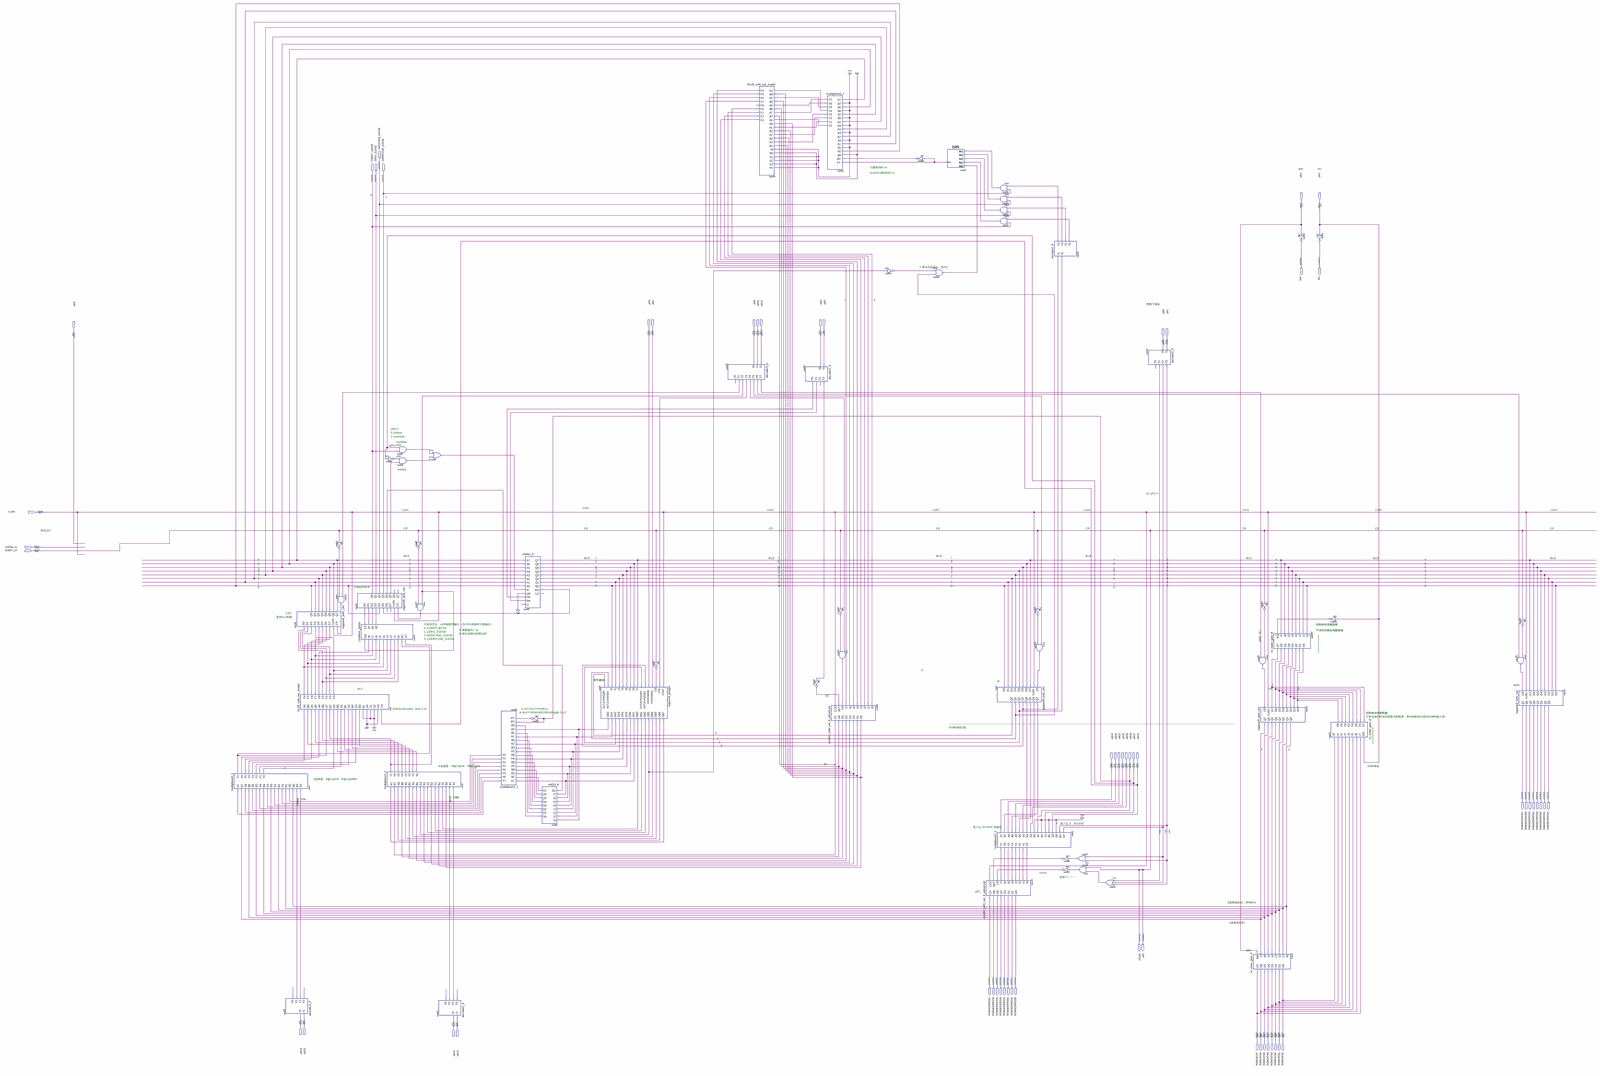
[diagram p0: schematic sheet, whole]
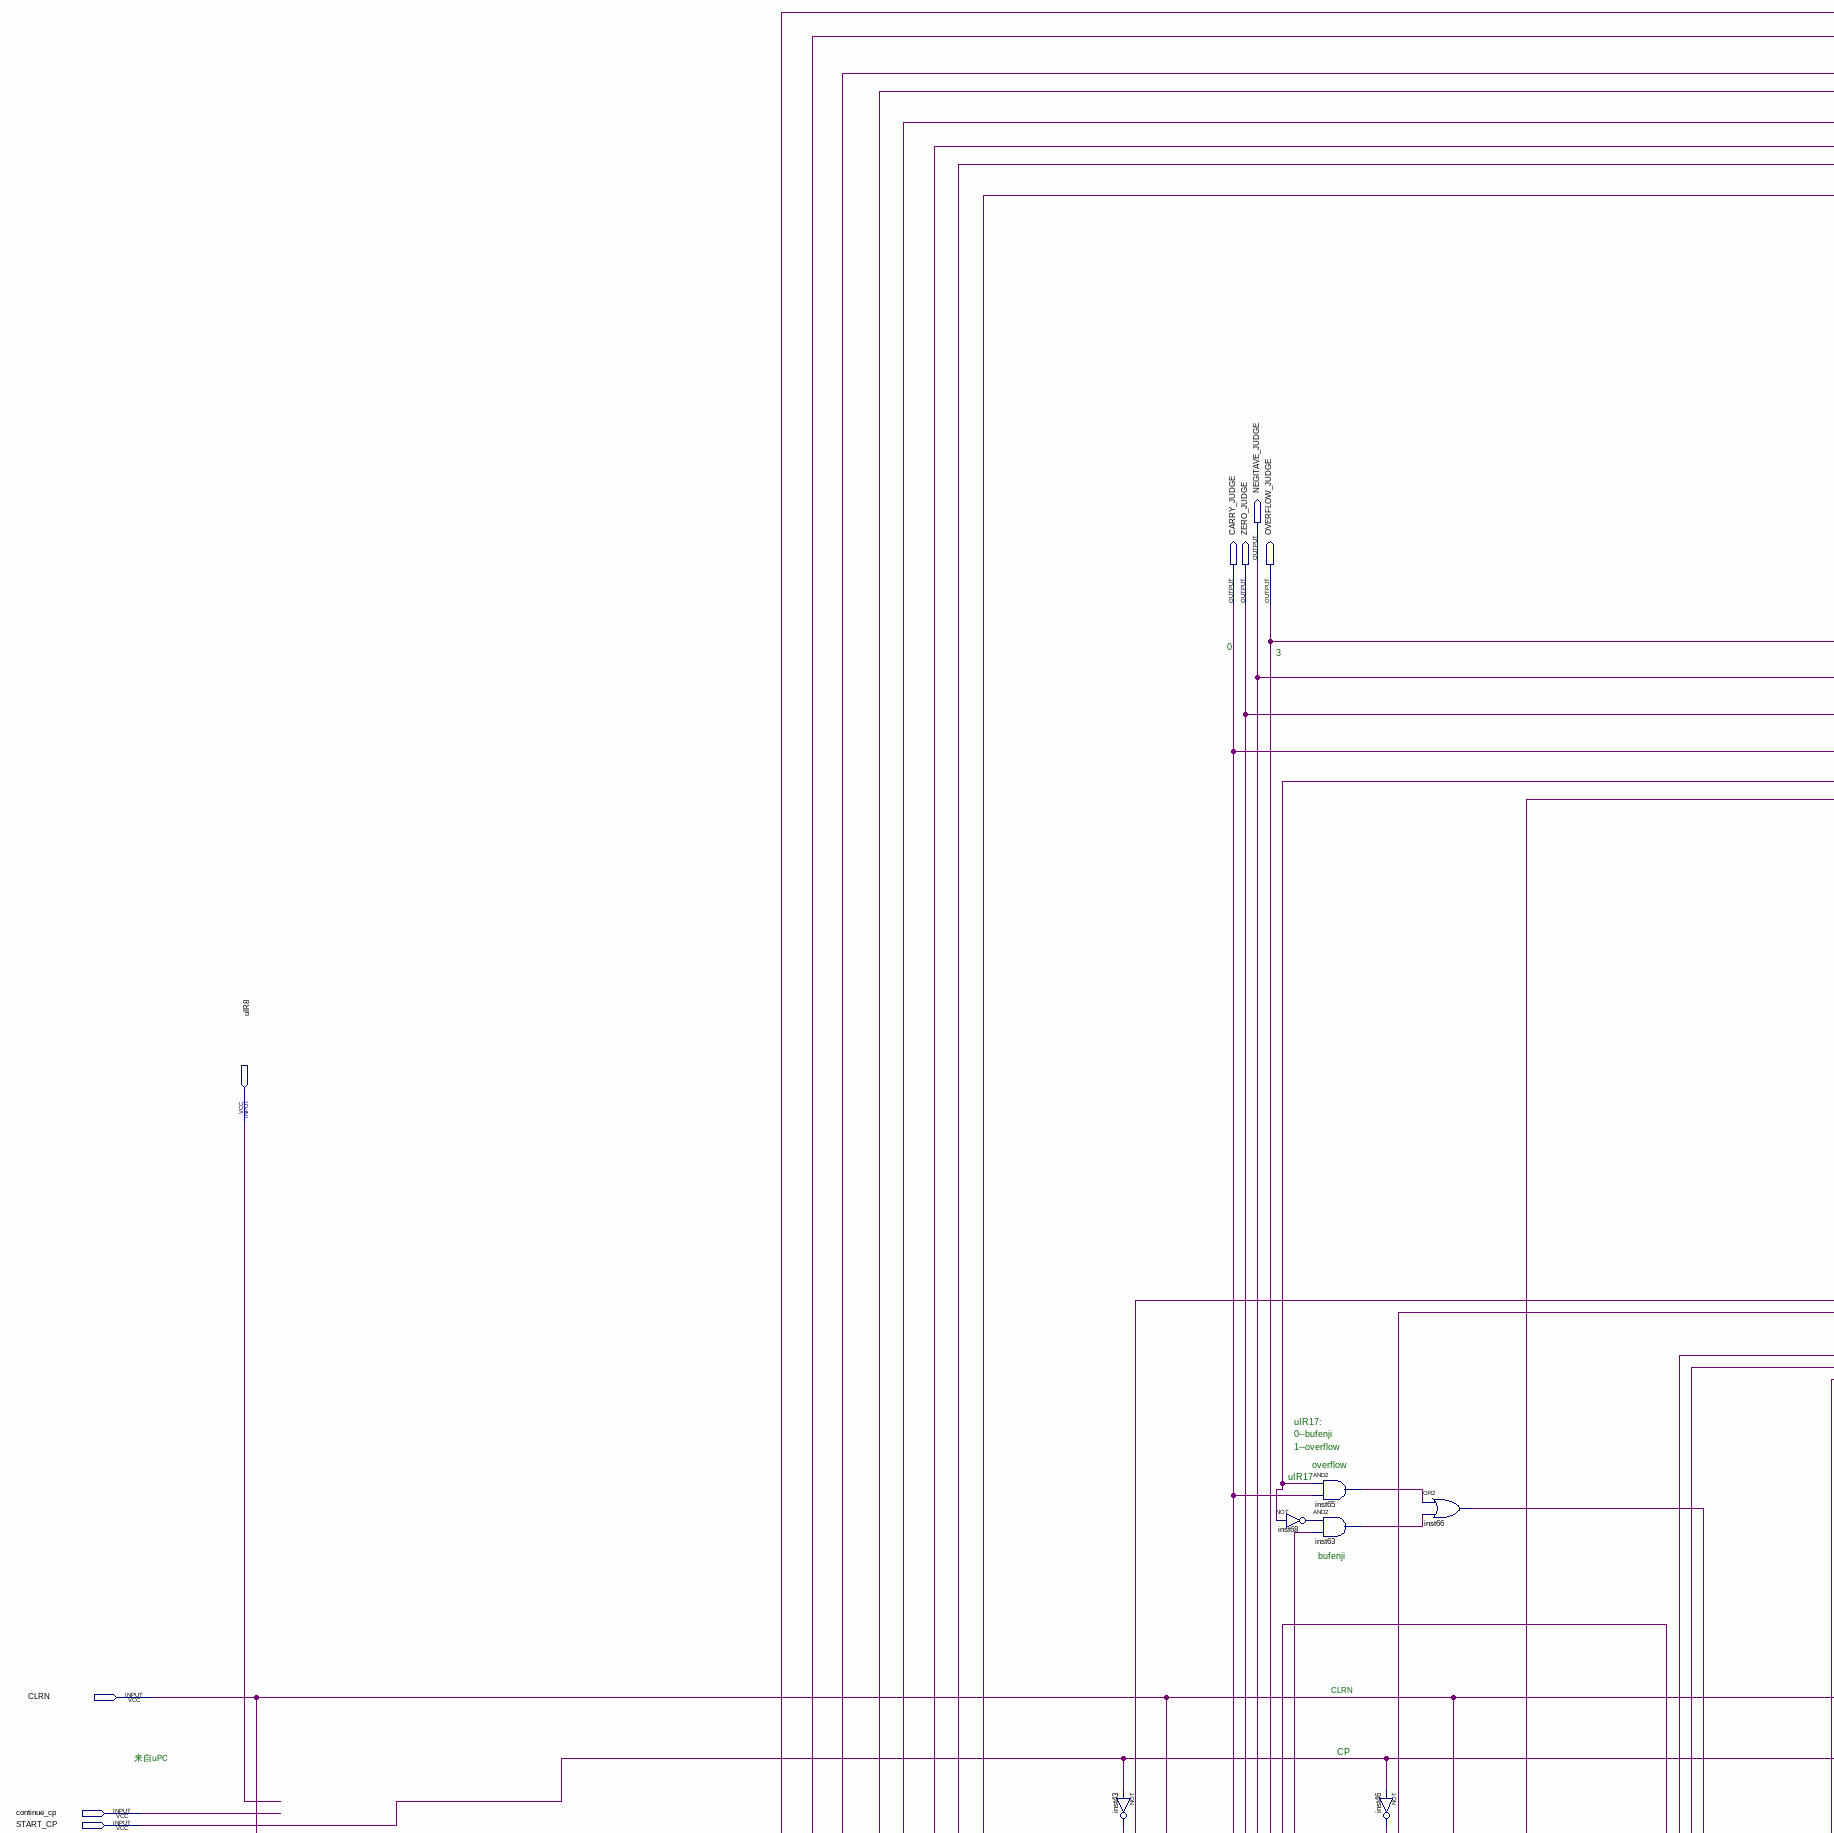
[diagram p1: schematic sheet, upper left part]
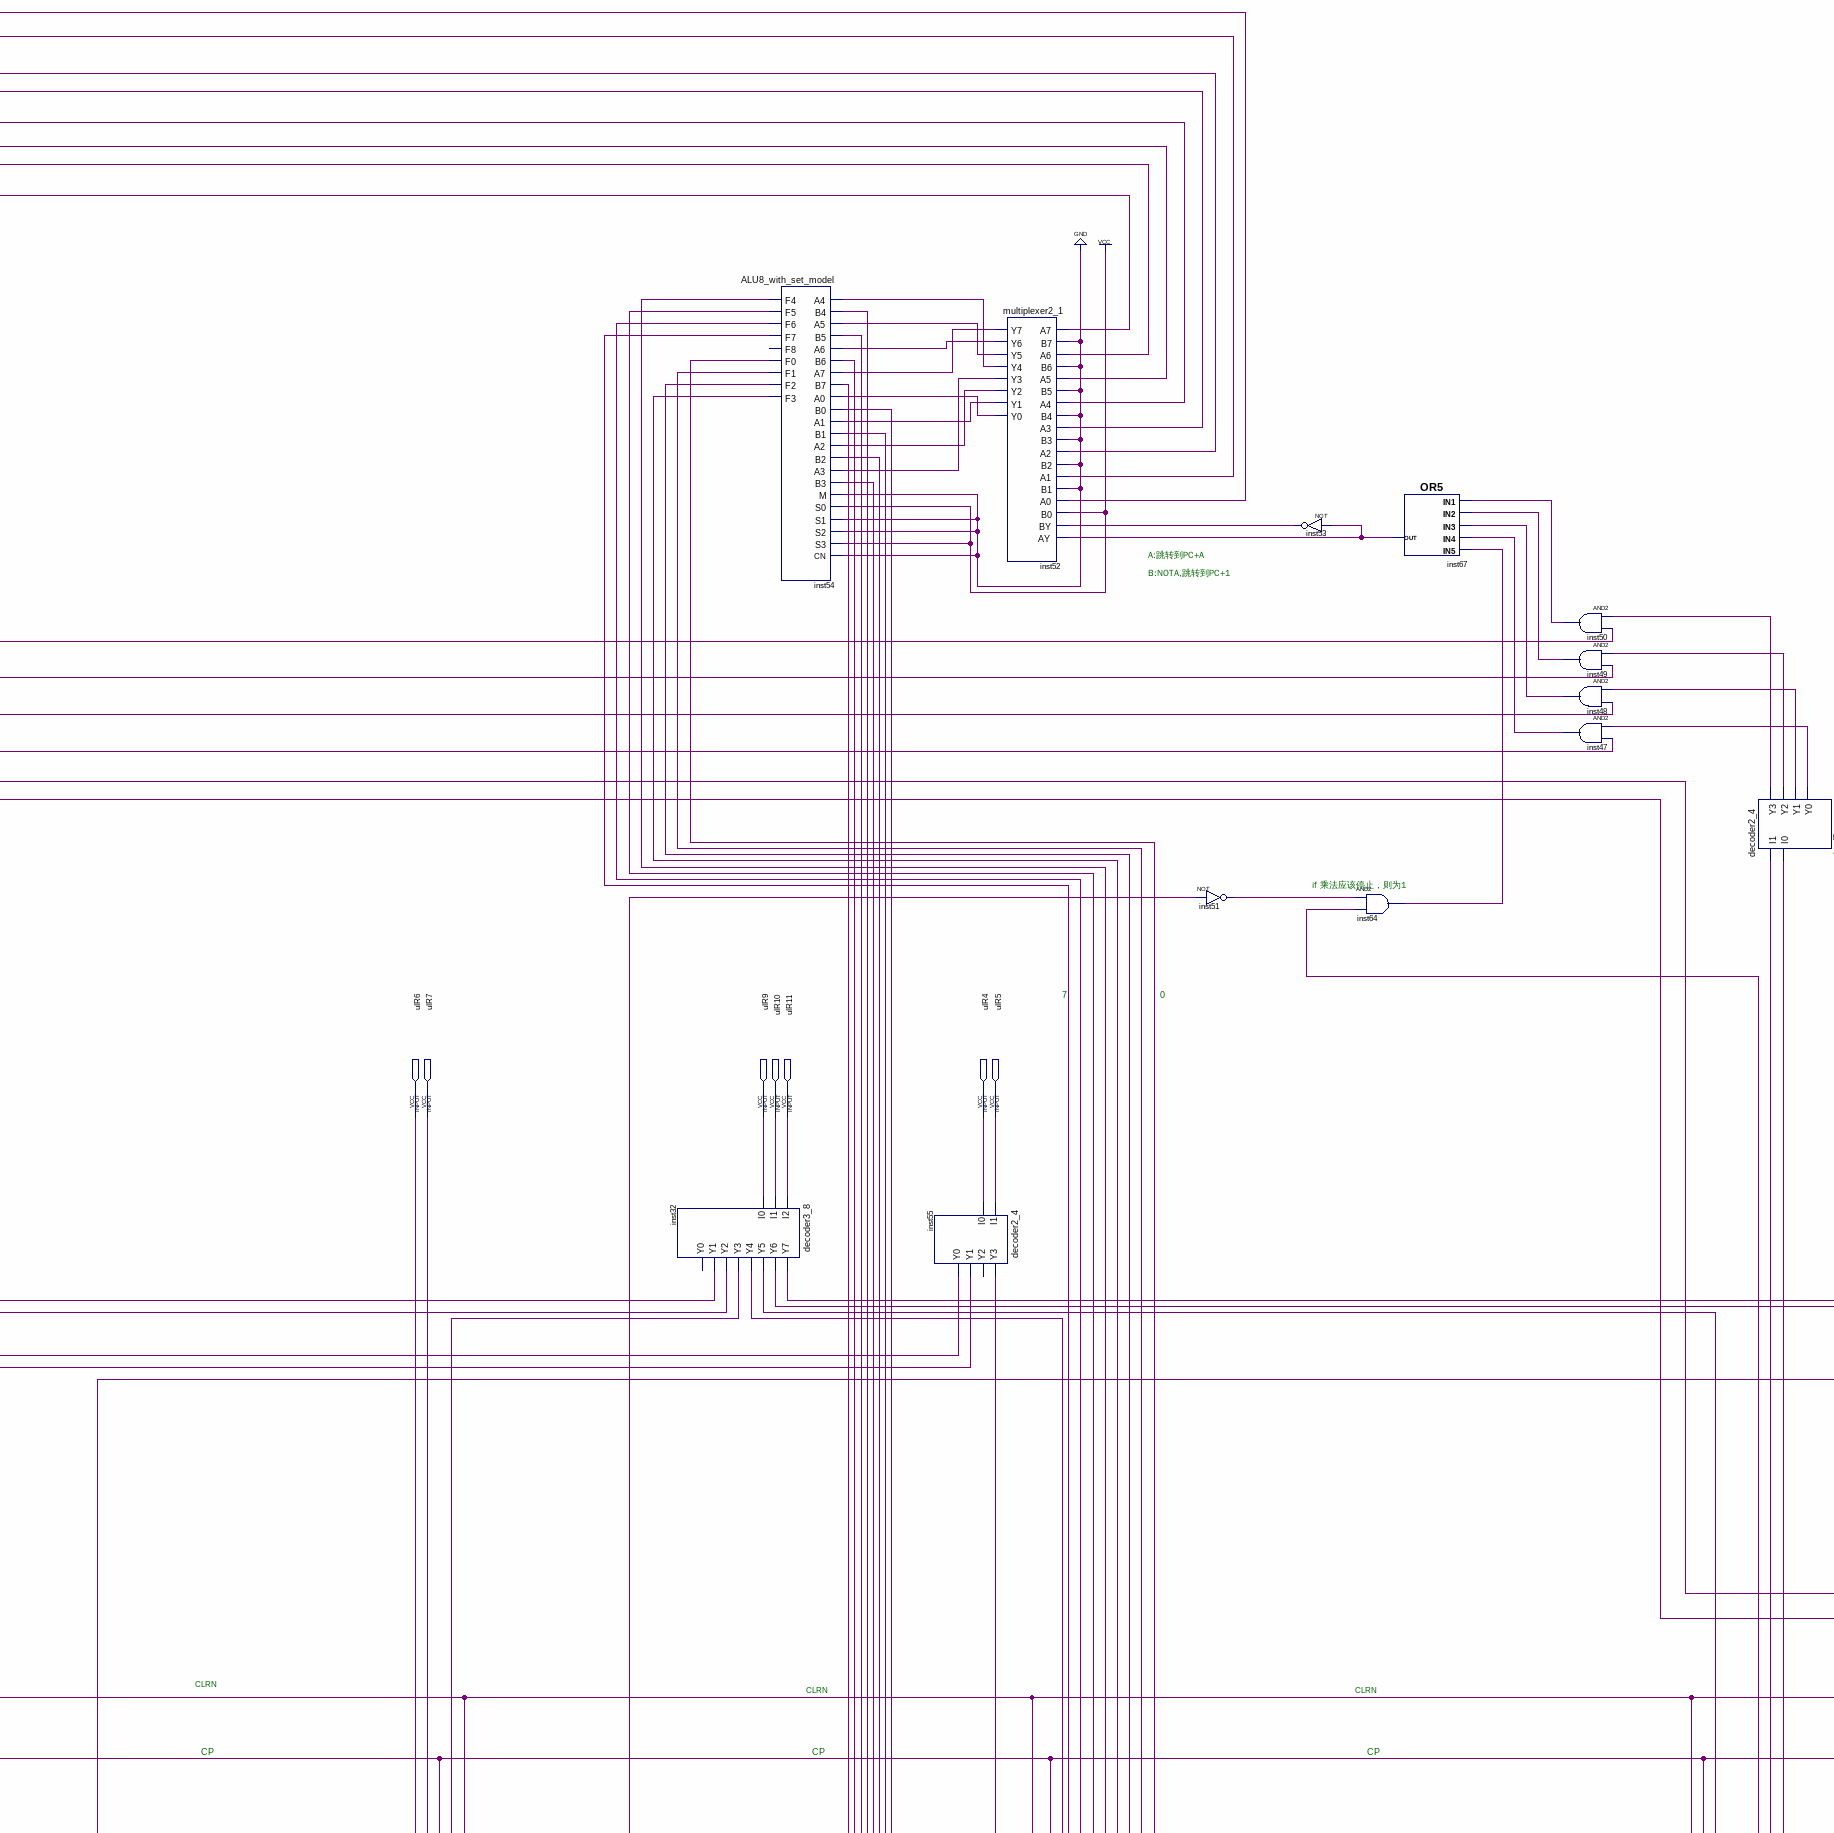
[diagram p2: schematic sheet, upper centre part]
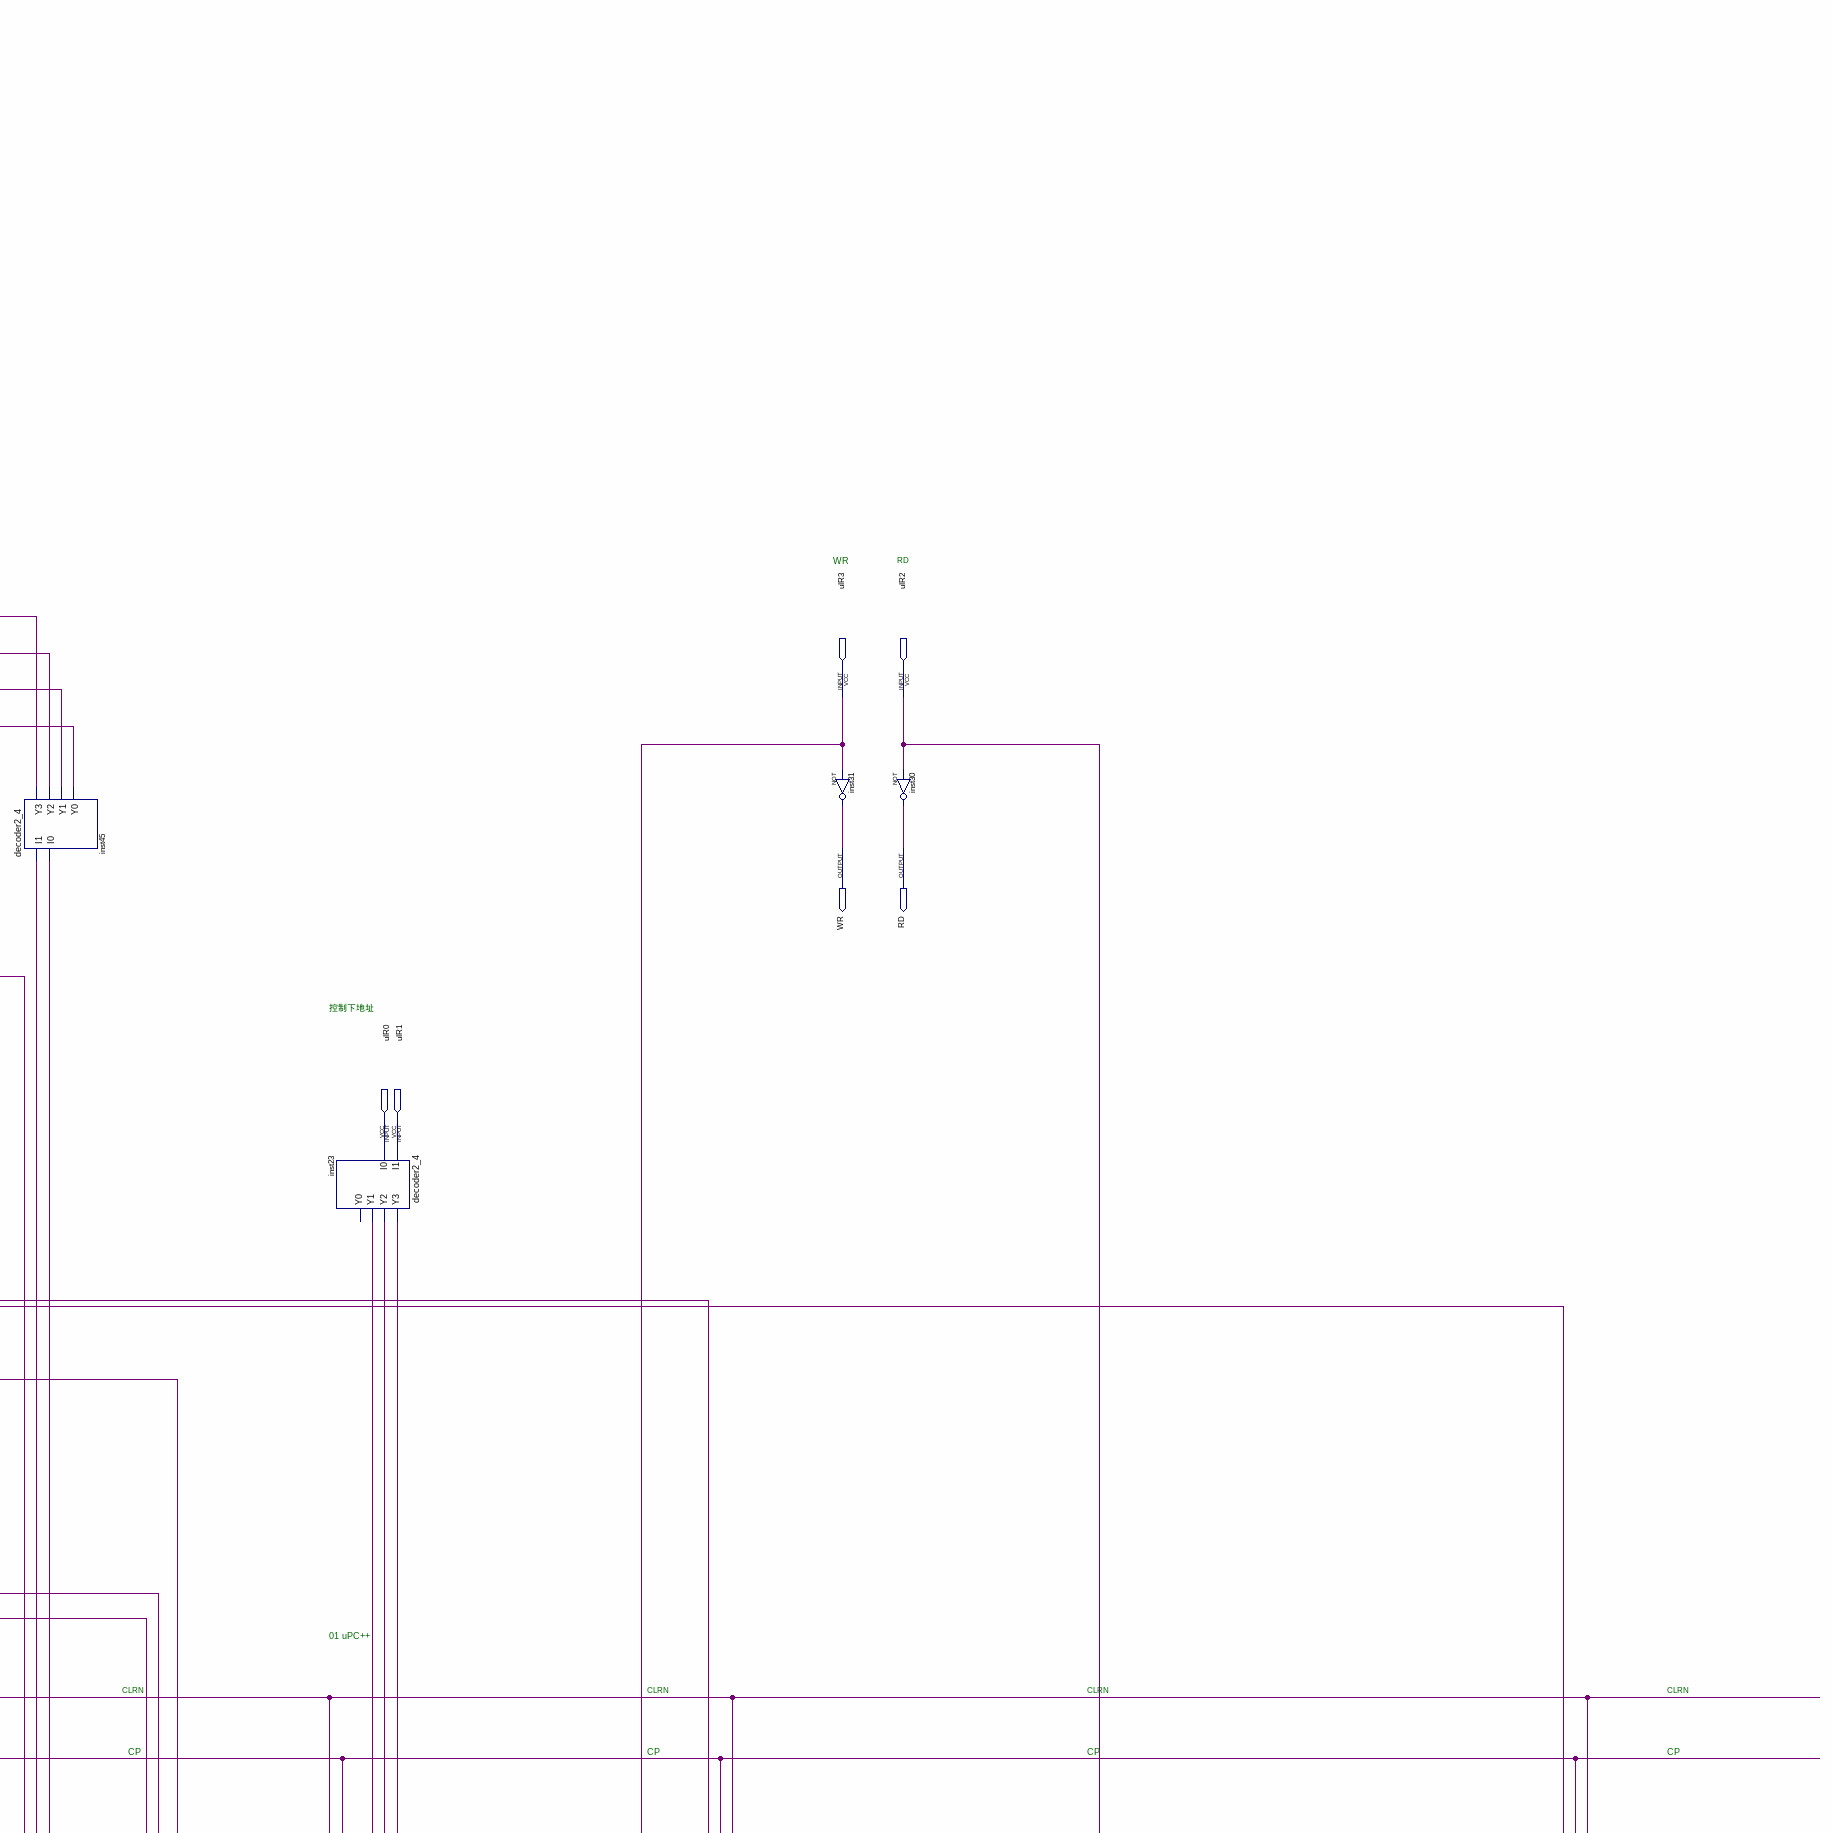
[diagram p3: schematic sheet, upper right part]
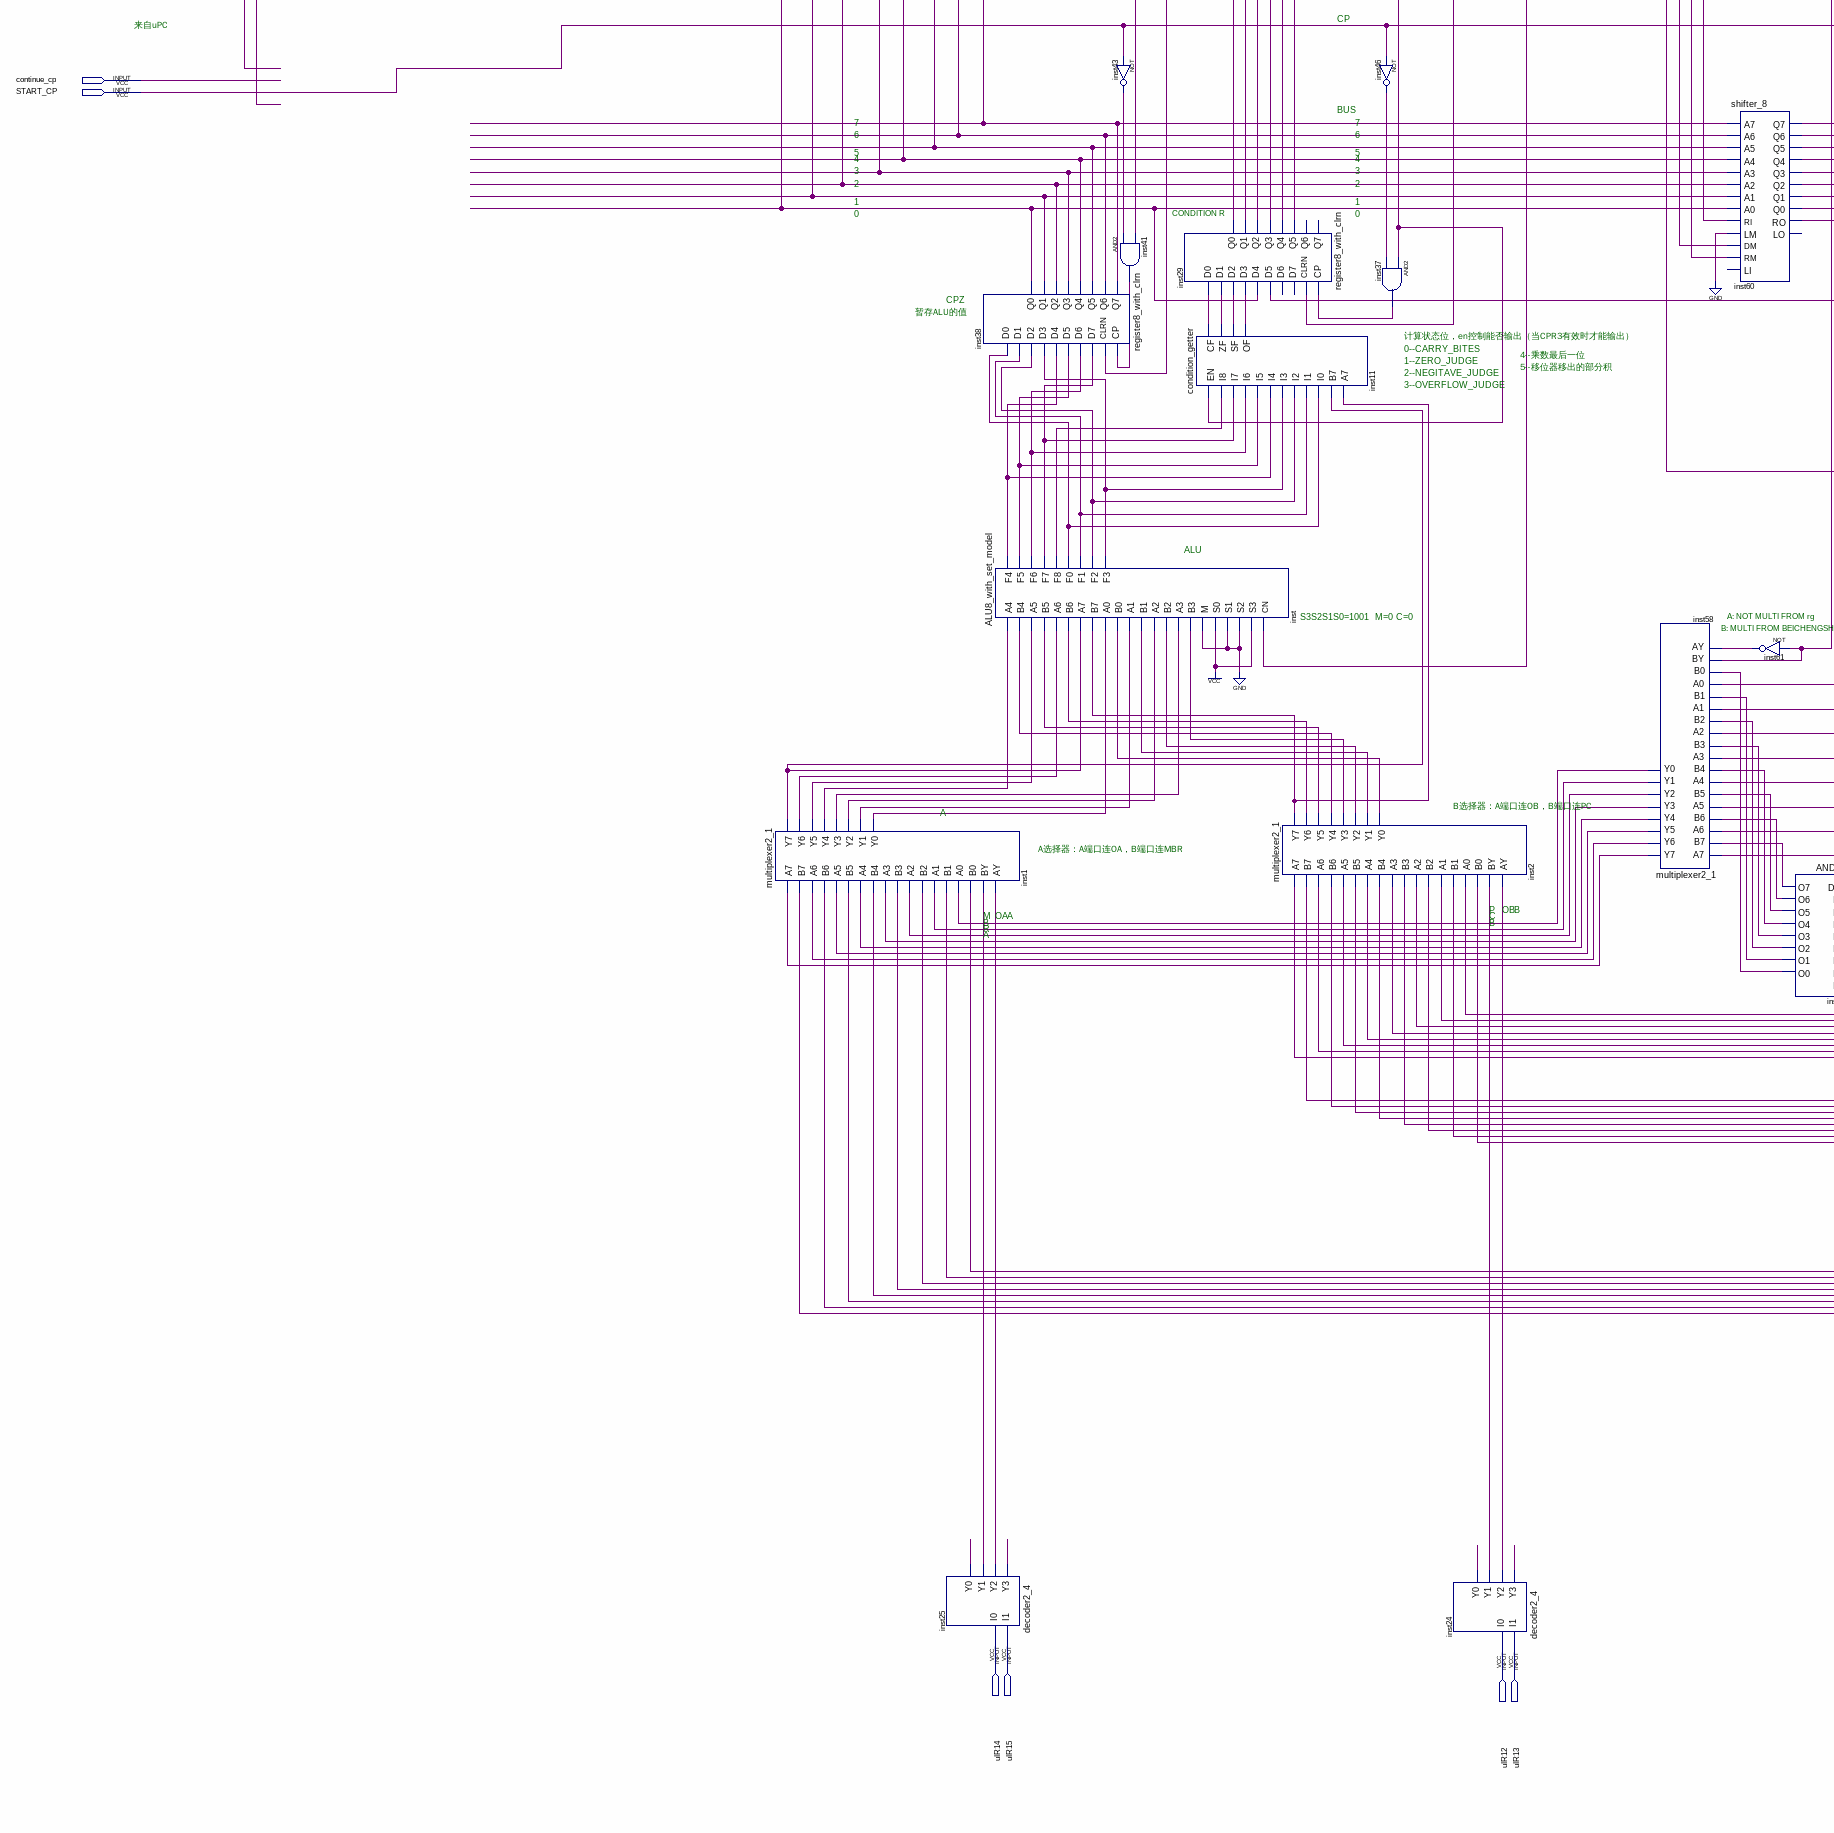
[diagram p4: schematic sheet, lower left part]
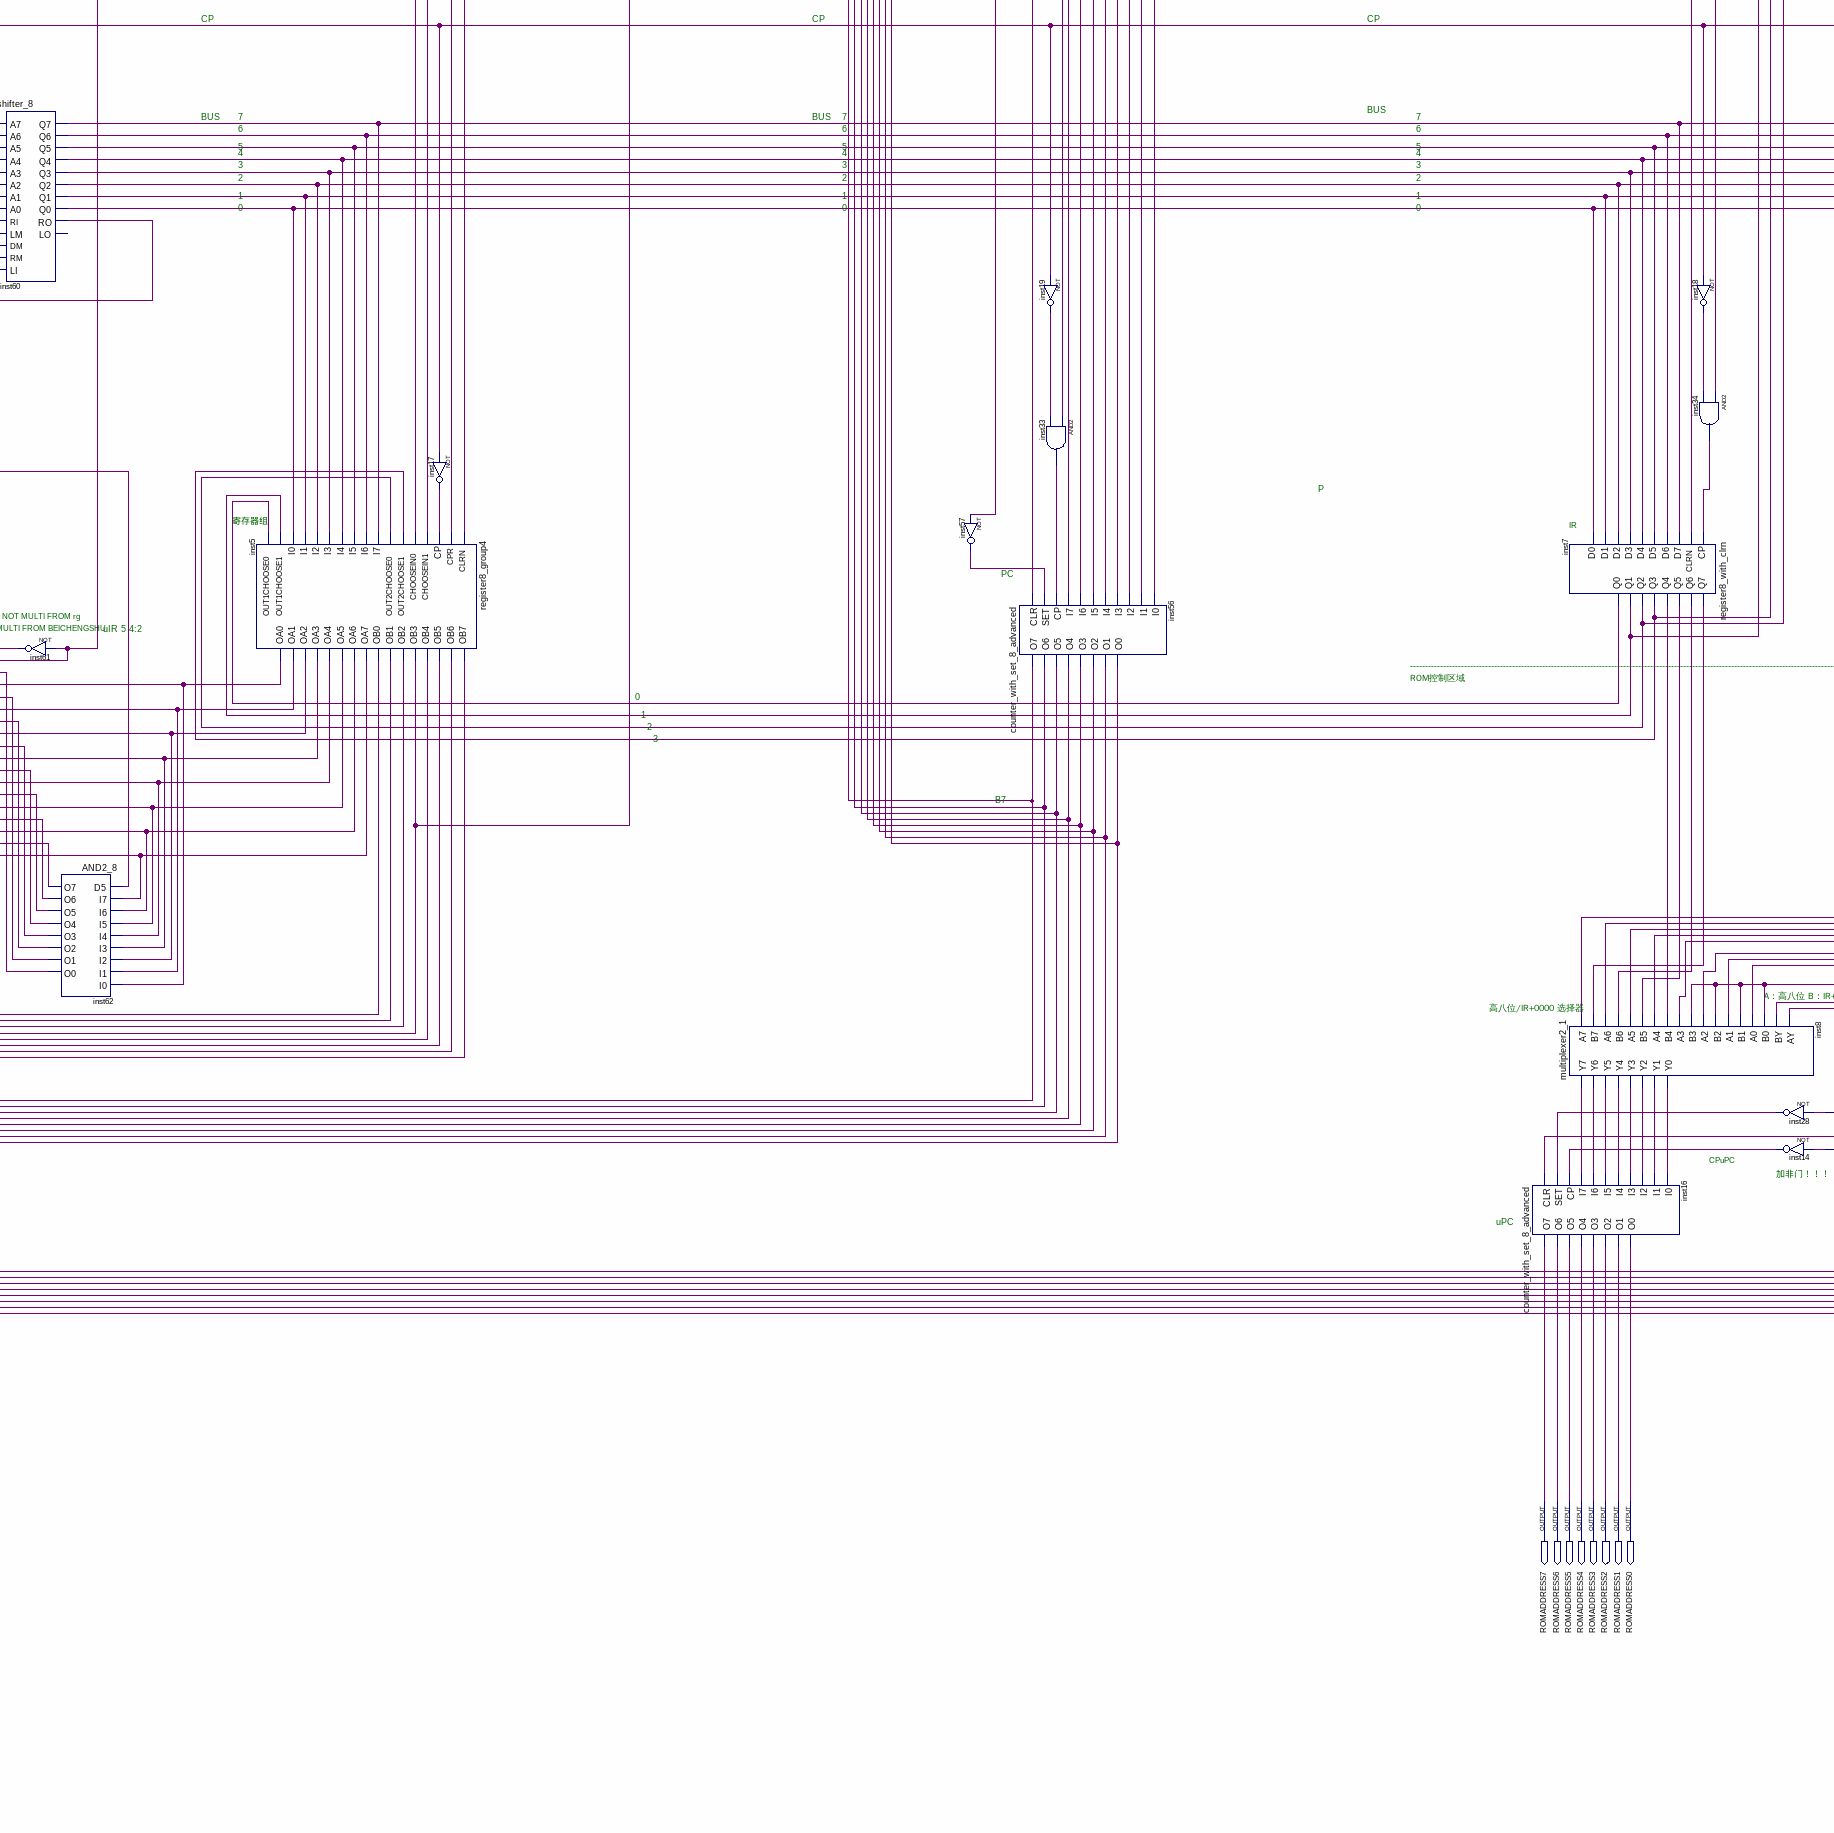
[diagram p5: schematic sheet, lower centre part]
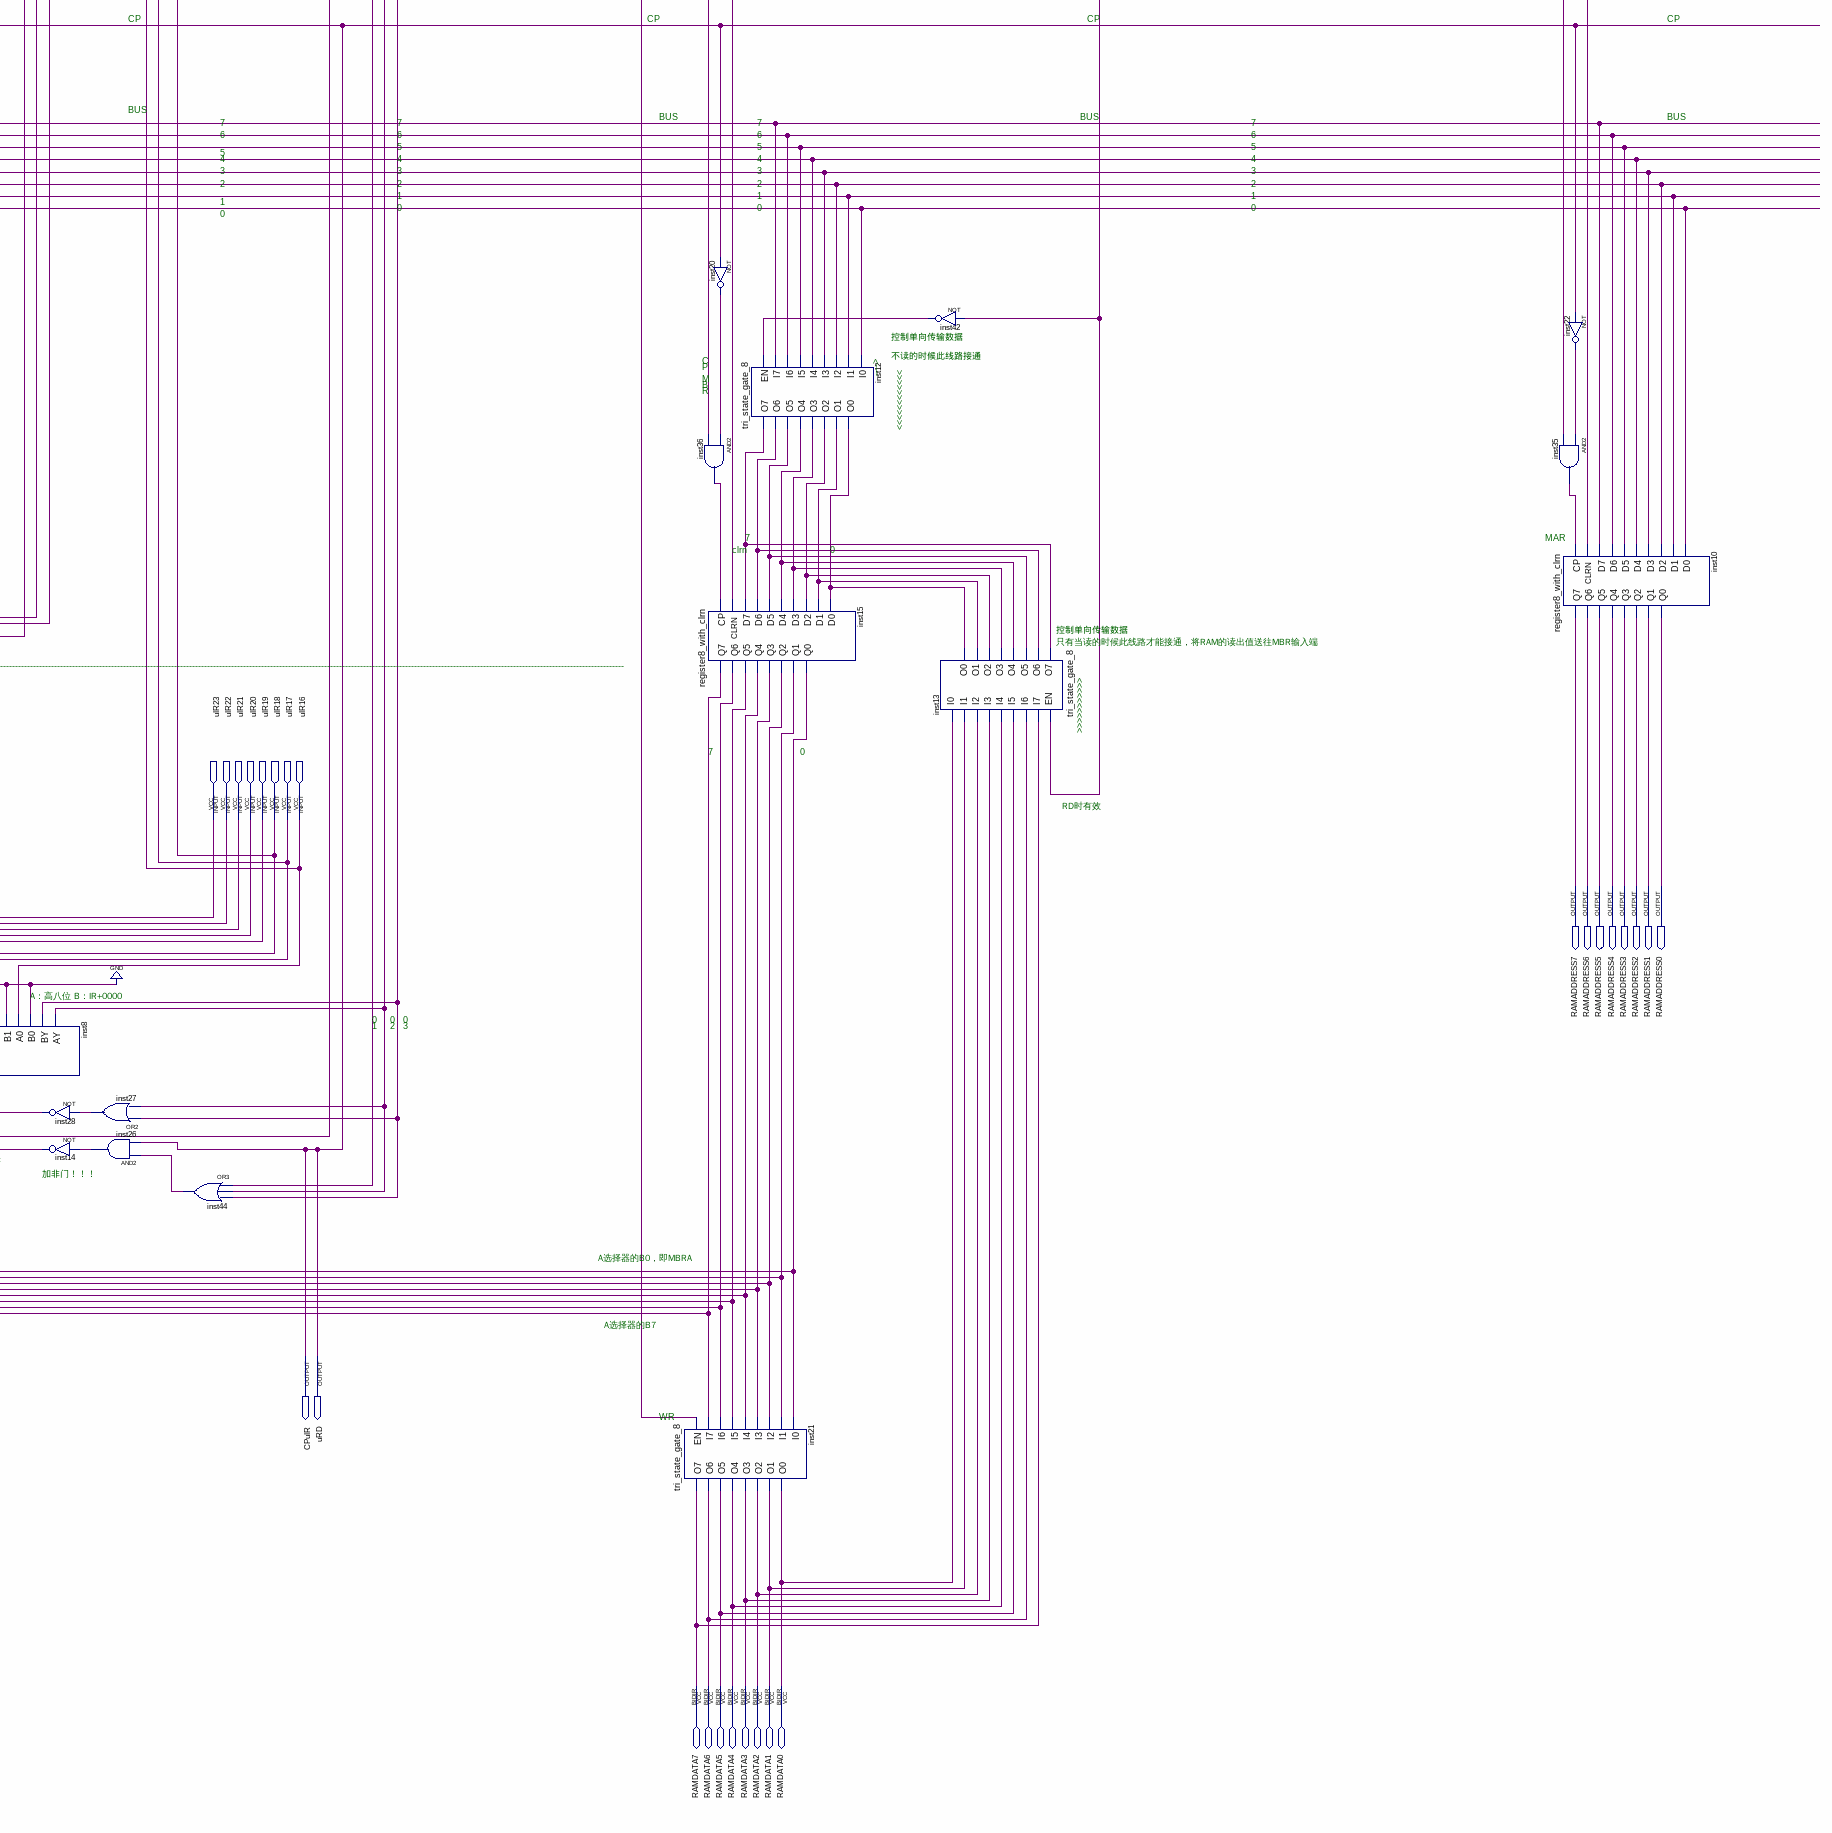
[diagram p6: schematic sheet, lower right part]
// Quartus schematic model_machine.bdf as structural Verilog: 62 symbols, 59 pins
module model_machine (
  input  uIR3,
  input  uIR2,
  input  uIR6,
  input  uIR7,
  input  uIR9,
  input  uIR10,
  input  uIR11,
  input  uIR4,
  input  uIR5,
  input  uIR8,
  input  uIR0,
  input  uIR1,
  input  CLRN,
  input  continue_cp,
  input  START_CP,
  input  uIR23,
  input  uIR22,
  input  uIR21,
  input  uIR20,
  input  uIR19,
  input  uIR18,
  input  uIR17,
  input  uIR16,
  input  uIR14,
  input  uIR15,
  input  uIR12,
  input  uIR13,
  inout  RAMDATA7,
  inout  RAMDATA6,
  inout  RAMDATA5,
  inout  RAMDATA4,
  inout  RAMDATA3,
  inout  RAMDATA2,
  inout  RAMDATA1,
  inout  RAMDATA0,
  output NEGITAVE_JUDGE,
  output CARRY_JUDGE,
  output ZERO_JUDGE,
  output OVERFLOW_JUDGE,
  output WR,
  output RD,
  output RAMADDRESS7,
  output RAMADDRESS6,
  output RAMADDRESS5,
  output RAMADDRESS4,
  output RAMADDRESS3,
  output RAMADDRESS2,
  output RAMADDRESS1,
  output RAMADDRESS0,
  output CPuIR,
  output uRD,
  output ROMADDRESS7,
  output ROMADDRESS6,
  output ROMADDRESS5,
  output ROMADDRESS4,
  output ROMADDRESS3,
  output ROMADDRESS2,
  output ROMADDRESS1,
  output ROMADDRESS0
);

  wire inst1_y0, inst1_y1, inst1_y2, inst1_y3, inst1_y4, inst1_y5, inst1_y6, inst1_y7, inst2_y0, inst2_y1,
       inst2_y2, inst2_y3, inst2_y4, inst2_y5, inst2_y6, inst2_y7, inst5_oa0, inst5_oa1, inst5_oa2,
       inst5_oa3, inst5_oa4, inst5_oa5, inst5_oa6, inst5_oa7, inst5_ob0, inst5_ob1, inst5_ob2, inst5_ob3,
       inst5_ob4, inst5_ob5, inst5_ob6, inst5_ob7, inst7_q0, inst7_q1, inst7_q2, inst7_q3, inst7_q4,
       inst7_q5, inst7_q6, inst7_q7, inst8_y0, inst8_y1, inst8_y2, inst8_y3, inst8_y4, inst8_y5, inst8_y6,
       inst8_y7, inst11_cf, inst11_of, inst11_sf, inst11_zf, inst12_o0, inst12_o1, inst12_o2, inst12_o3,
       inst12_o4, inst12_o5, inst12_o6, inst12_o7, inst14_out, inst15_q0, inst15_q1, inst15_q2, inst15_q3,
       inst15_q4, inst15_q5, inst15_q6, inst15_q7, inst17_out, inst18_out, inst19_out, inst20_out,
       inst22_out, inst23_y1, inst23_y2, inst23_y3, inst24_y0, inst24_y1, inst24_y2, inst24_y3, inst25_y0,
       inst25_y1, inst25_y2, inst25_y3, inst26_out, inst27_out, inst28_out, inst29_q4, inst29_q5, inst32_y1,
       inst32_y2, inst32_y3, inst32_y4, inst32_y5, inst32_y6, inst32_y7, inst33_out, inst34_out, inst35_out,
       inst36_out, inst37_out, inst38_q0, inst38_q1, inst38_q2, inst38_q3, inst38_q4, inst38_q5, inst38_q6,
       inst38_q7, inst41_out, inst42_out, inst43_out, inst44_out, inst45_y0, inst45_y1, inst45_y2, inst45_y3,
       inst46_out, inst47_out, inst48_out, inst49_out, inst50_out, inst51_out, inst52_y0, inst52_y1,
       inst52_y2, inst52_y3, inst52_y4, inst52_y5, inst52_y6, inst52_y7, inst53_out, inst54_f0, inst54_f1,
       inst54_f2, inst54_f3, inst54_f4, inst54_f5, inst54_f6, inst54_f7, inst55_y0, inst55_y1, inst55_y3,
       inst56_o0, inst56_o1, inst56_o2, inst56_o3, inst56_o4, inst56_o5, inst56_o6, inst56_o7, inst57_out,
       inst58_y0, inst58_y1, inst58_y2, inst58_y3, inst58_y4, inst58_y5, inst58_y6, inst58_y7, inst60_q0,
       inst60_q1, inst60_q2, inst60_q3, inst60_q4, inst60_q5, inst60_q6, inst60_q7, inst60_ro, inst61_out,
       inst62_o0, inst62_o1, inst62_o2, inst62_o3, inst62_o4, inst62_o5, inst62_o6, inst62_o7, inst63_out,
       inst64_out, inst65_out, inst66_out, inst67_out, inst68_out, inst_f0, inst_f1, inst_f2, inst_f3,
       inst_f4, inst_f5, inst_f6, inst_f7, inst_f8;

  multiplexer2_1 inst1 (
    .A7(inst58_y7), .B7(inst15_q7), .A6(inst58_y6), .B6(inst15_q6), .A5(inst58_y5), .B5(inst15_q5),
    .A4(inst58_y4), .B4(inst15_q4), .A3(inst58_y3), .B3(inst15_q3), .A2(inst58_y2), .B2(inst15_q2),
    .A1(inst58_y1), .B1(inst15_q1), .A0(inst58_y0), .B0(inst15_q0), .BY(inst25_y1), .AY(inst25_y2),
    .Y7(inst1_y7), .Y6(inst1_y6), .Y5(inst1_y5), .Y4(inst1_y4), .Y3(inst1_y3), .Y2(inst1_y2), .Y1(inst1_y1),
    .Y0(inst1_y0));
  decoder2_4 inst25 (.I1(uIR15), .I0(uIR14), .Y3(inst25_y3), .Y2(inst25_y2), .Y1(inst25_y1), .Y0(inst25_y0));
  register8_with_clrn inst38 (
    .CP(inst41_out), .CLRN(CLRN), .D7(inst_f7), .D6(inst_f6), .D5(inst_f5), .D4(inst_f4), .D3(inst_f3),
    .D2(inst_f2), .D1(inst_f1), .D0(inst_f0), .Q7(inst38_q7), .Q6(inst38_q6), .Q5(inst38_q5), .Q4(inst38_q4),
    .Q3(inst38_q3), .Q2(inst38_q2), .Q1(inst38_q1), .Q0(inst38_q0));
  ALU8_with_set_model inst (
    .A4(inst1_y4), .B4(inst2_y4), .A5(inst1_y5), .B5(inst2_y5), .A6(inst1_y6), .B6(inst2_y6), .A7(inst1_y7),
    .B7(inst2_y7), .A0(inst1_y0), .B0(inst2_y0), .A1(inst1_y1), .B1(inst2_y1), .A2(inst1_y2), .B2(inst2_y2),
    .A3(inst1_y3), .B3(inst2_y3), .M(1'b0), .S0(1'b1), .S1(1'b0), .S2(1'b0), .S3(1'b1), .CN(uIR16),
    .F4(inst_f4), .F5(inst_f5), .F6(inst_f6), .F7(inst_f7), .F8(inst_f8), .F0(inst_f0), .F1(inst_f1),
    .F2(inst_f2), .F3(inst_f3));
  not inst43 (inst43_out, START_CP);
  and inst41 (inst41_out, inst43_out, inst32_y1);
  register8_with_clrn inst29 (
    .CP(inst37_out), .CLRN(CLRN), .D5(inst60_ro), .D4(inst38_q0), .D3(inst11_of), .D2(inst11_sf),
    .D1(inst11_zf), .D0(inst11_cf), .Q5(inst29_q5), .Q4(inst29_q4), .Q3(OVERFLOW_JUDGE), .Q2(NEGITAVE_JUDGE),
    .Q1(ZERO_JUDGE), .Q0(CARRY_JUDGE));  // open: D7, D6, Q7, Q6
  condition_getter inst11 (
    .EN(inst32_y2), .I8(inst_f8), .I7(inst_f7), .I6(inst_f6), .I5(inst_f5), .I4(inst_f4), .I3(inst_f3),
    .I2(inst_f2), .I1(inst_f1), .I0(inst_f0), .B7(inst1_y7), .A7(inst2_y7), .CF(inst11_cf), .ZF(inst11_zf),
    .SF(inst11_sf), .OF(inst11_of));
  not inst68 (inst68_out, uIR17);
  multiplexer2_1 inst2 (
    .A7(inst5_ob7), .B7(inst56_o7), .A6(inst5_ob6), .B6(inst56_o6), .A5(inst5_ob5), .B5(inst56_o5),
    .A4(inst5_ob4), .B4(inst56_o4), .A3(inst5_ob3), .B3(inst56_o3), .A2(inst5_ob2), .B2(inst56_o2),
    .A1(inst5_ob1), .B1(inst56_o1), .A0(inst5_ob0), .B0(inst56_o0), .BY(inst24_y1), .AY(inst24_y2),
    .Y7(inst2_y7), .Y6(inst2_y6), .Y5(inst2_y5), .Y4(inst2_y4), .Y3(inst2_y3), .Y2(inst2_y2), .Y1(inst2_y1),
    .Y0(inst2_y0));
  and inst65 (inst65_out, uIR17, CARRY_JUDGE);
  and inst63 (inst63_out, inst68_out, inst29_q5);
  not inst46 (inst46_out, START_CP);
  and inst37 (inst37_out, inst32_y2, inst46_out);
  or inst66 (inst66_out, inst65_out, inst63_out);
  decoder2_4 inst24 (.I1(uIR13), .I0(uIR12), .Y3(inst24_y3), .Y2(inst24_y2), .Y1(inst24_y1), .Y0(inst24_y0));
  multiplexer2_1 inst58 (
    .A7(inst5_oa7), .B7(inst62_o7), .A6(inst5_oa6), .B6(inst62_o6), .A5(inst5_oa5), .B5(inst62_o5),
    .A4(inst5_oa4), .B4(inst62_o4), .A3(inst5_oa3), .B3(inst62_o3), .A2(inst5_oa2), .B2(inst62_o2),
    .A1(inst5_oa1), .B1(inst62_o1), .A0(inst5_oa0), .B0(inst62_o0), .BY(uIR18), .AY(inst61_out),
    .Y7(inst58_y7), .Y6(inst58_y6), .Y5(inst58_y5), .Y4(inst58_y4), .Y3(inst58_y3), .Y2(inst58_y2),
    .Y1(inst58_y1), .Y0(inst58_y0));
  shifter_8 inst60 (
    .A7(inst38_q7), .A6(inst38_q6), .A5(inst38_q5), .A4(inst38_q4), .A3(inst38_q3), .A2(inst38_q2),
    .A1(inst38_q1), .A0(inst38_q0), .RI(inst66_out), .LM(1'b0), .DM(inst55_y0), .RM(inst55_y1),
    .Q7(inst60_q7), .Q6(inst60_q6), .Q5(inst60_q5), .Q4(inst60_q4), .Q3(inst60_q3), .Q2(inst60_q2),
    .Q1(inst60_q1), .Q0(inst60_q0), .RO(inst60_ro));  // open: LI, LO
  not inst61 (inst61_out, uIR18);
  AND2_8 inst62 (
    .D5(inst29_q4), .I7(inst5_oa7), .I6(inst5_oa6), .I5(inst5_oa5), .I4(inst5_oa4), .I3(inst5_oa3),
    .I2(inst5_oa2), .I1(inst5_oa1), .I0(inst5_oa0), .O7(inst62_o7), .O6(inst62_o6), .O5(inst62_o5),
    .O4(inst62_o4), .O3(inst62_o3), .O2(inst62_o2), .O1(inst62_o1), .O0(inst62_o0));
  register8_group4 inst5 (
    .CLRN(CLRN), .CPR(inst32_y3), .CP(inst17_out), .CHOOSEIN1(uIR7), .CHOOSEIN0(uIR6),
    .OUT2CHOOSE1(inst7_q3), .OUT2CHOOSE0(inst7_q2), .I7(inst60_q7), .I6(inst60_q6), .I5(inst60_q5),
    .I4(inst60_q4), .I3(inst60_q3), .I2(inst60_q2), .I1(inst60_q1), .I0(inst60_q0), .OUT1CHOOSE1(inst7_q1),
    .OUT1CHOOSE0(inst7_q0), .OB7(inst5_ob7), .OB6(inst5_ob6), .OB5(inst5_ob5), .OB4(inst5_ob4),
    .OB3(inst5_ob3), .OB2(inst5_ob2), .OB1(inst5_ob1), .OB0(inst5_ob0), .OA7(inst5_oa7), .OA6(inst5_oa6),
    .OA5(inst5_oa5), .OA4(inst5_oa4), .OA3(inst5_oa3), .OA2(inst5_oa2), .OA1(inst5_oa1), .OA0(inst5_oa0));
  not inst17 (inst17_out, START_CP);
  decoder3_8 inst32 (
    .I2(uIR11), .I1(uIR10), .I0(uIR9), .Y7(inst32_y7), .Y6(inst32_y6), .Y5(inst32_y5), .Y4(inst32_y4),
    .Y3(inst32_y3), .Y2(inst32_y2), .Y1(inst32_y1));  // open: Y0
  ALU8_with_set_model inst54 (
    .A4(inst52_y4), .B4(inst56_o4), .A5(inst52_y5), .B5(inst56_o5), .A6(inst52_y6), .B6(inst56_o6),
    .A7(inst52_y7), .B7(inst56_o7), .A0(inst52_y0), .B0(inst56_o0), .A1(inst52_y1), .B1(inst56_o1),
    .A2(inst52_y2), .B2(inst56_o2), .A3(inst52_y3), .B3(inst56_o3), .M(1'b0), .S0(1'b1), .S1(1'b0),
    .S2(1'b0), .S3(1'b1), .CN(1'b0), .F4(inst54_f4), .F5(inst54_f5), .F6(inst54_f6), .F7(inst54_f7),
    .F0(inst54_f0), .F1(inst54_f1), .F2(inst54_f2), .F3(inst54_f3));  // open: F8
  decoder2_4 inst55 (.I1(uIR5), .I0(uIR4), .Y3(inst55_y3), .Y1(inst55_y1), .Y0(inst55_y0));  // open: Y2
  not inst57 (inst57_out, inst55_y3);
  multiplexer2_1 inst52 (
    .A7(inst38_q7), .B7(1'b0), .A6(inst38_q6), .B6(1'b0), .A5(inst38_q5), .B5(1'b0), .A4(inst38_q4),
    .B4(1'b0), .A3(inst38_q3), .B3(1'b0), .A2(inst38_q2), .B2(1'b0), .A1(inst38_q1), .B1(1'b0),
    .A0(inst38_q0), .B0(1'b1), .BY(inst53_out), .AY(inst67_out), .Y7(inst52_y7), .Y6(inst52_y6),
    .Y5(inst52_y5), .Y4(inst52_y4), .Y3(inst52_y3), .Y2(inst52_y2), .Y1(inst52_y1), .Y0(inst52_y0));
  counter_with_set_8_advanced inst56 (
    .CLR(CLRN), .SET(inst57_out), .CP(inst33_out), .I7(inst54_f7), .I6(inst54_f6), .I5(inst54_f5),
    .I4(inst54_f4), .I3(inst54_f3), .I2(inst54_f2), .I1(inst54_f1), .I0(inst54_f0), .O7(inst56_o7),
    .O6(inst56_o6), .O5(inst56_o5), .O4(inst56_o4), .O3(inst56_o3), .O2(inst56_o2), .O1(inst56_o1),
    .O0(inst56_o0));
  not inst19 (inst19_out, START_CP);
  and inst33 (inst33_out, inst32_y4, inst19_out);
  not inst51 (inst51_out, inst5_ob3);
  not inst53 (inst53_out, inst67_out);
  and inst64 (inst64_out, inst51_out, inst7_q1);
  or inst67 (inst67_out, inst50_out, inst49_out, inst48_out, inst47_out, inst64_out);
  counter_with_set_8_advanced inst16 (
    .CLR(CLRN), .SET(inst28_out), .CP(inst14_out), .I7(inst8_y7), .I6(inst8_y6), .I5(inst8_y5),
    .I4(inst8_y4), .I3(inst8_y3), .I2(inst8_y2), .I1(inst8_y1), .I0(inst8_y0), .O7(ROMADDRESS7),
    .O6(ROMADDRESS6), .O5(ROMADDRESS5), .O4(ROMADDRESS4), .O3(ROMADDRESS3), .O2(ROMADDRESS2),
    .O1(ROMADDRESS1), .O0(ROMADDRESS0));
  and inst50 (inst50_out, inst45_y3, OVERFLOW_JUDGE);
  and inst49 (inst49_out, inst45_y2, NEGITAVE_JUDGE);
  and inst48 (inst48_out, inst45_y1, ZERO_JUDGE);
  and inst47 (inst47_out, inst45_y0, CARRY_JUDGE);
  register8_with_clrn inst7 (
    .CP(inst34_out), .CLRN(CLRN), .D7(inst60_q7), .D6(inst60_q6), .D5(inst60_q5), .D4(inst60_q4),
    .D3(inst60_q3), .D2(inst60_q2), .D1(inst60_q1), .D0(inst60_q0), .Q7(inst7_q7), .Q6(inst7_q6),
    .Q5(inst7_q5), .Q4(inst7_q4), .Q3(inst7_q3), .Q2(inst7_q2), .Q1(inst7_q1), .Q0(inst7_q0));
  multiplexer2_1 inst8 (
    .A7(uIR23), .B7(inst7_q7), .A6(uIR22), .B6(inst7_q6), .A5(uIR21), .B5(inst7_q5), .A4(uIR20),
    .B4(inst7_q4), .A3(uIR19), .B3(1'b0), .A2(uIR18), .B2(1'b0), .A1(uIR17), .B1(1'b0), .A0(uIR16),
    .B0(1'b0), .BY(inst23_y3), .AY(inst23_y2), .Y7(inst8_y7), .Y6(inst8_y6), .Y5(inst8_y5), .Y4(inst8_y4),
    .Y3(inst8_y3), .Y2(inst8_y2), .Y1(inst8_y1), .Y0(inst8_y0));
  not inst18 (inst18_out, START_CP);
  and inst34 (inst34_out, inst32_y5, inst18_out);
  decoder2_4 inst45 (.I1(inst7_q3), .I0(inst7_q2), .Y3(inst45_y3), .Y2(inst45_y2), .Y1(inst45_y1), .Y0(inst45_y0));
  not inst28 (inst28_out, inst27_out);
  not inst14 (inst14_out, inst26_out);
  or inst27 (inst27_out, inst23_y3, inst23_y2);
  and inst26 (inst26_out, inst44_out, START_CP);
  or inst44 (inst44_out, inst23_y1, inst23_y2, inst23_y3);
  decoder2_4 inst23 (.I1(uIR1), .I0(uIR0), .Y3(inst23_y3), .Y2(inst23_y2), .Y1(inst23_y1));  // open: Y0
  not inst20 (inst20_out, START_CP);
  and inst36 (inst36_out, inst20_out, inst32_y7);
  register8_with_clrn inst15 (
    .CP(inst36_out), .CLRN(CLRN), .D7(inst12_o7), .D6(inst12_o6), .D5(inst12_o5), .D4(inst12_o4),
    .D3(inst12_o3), .D2(inst12_o2), .D1(inst12_o1), .D0(inst12_o0), .Q7(inst15_q7), .Q6(inst15_q6),
    .Q5(inst15_q5), .Q4(inst15_q4), .Q3(inst15_q3), .Q2(inst15_q2), .Q1(inst15_q1), .Q0(inst15_q0));
  tri_state_gate_8 inst21 (
    .EN(uIR3), .I7(inst15_q7), .I6(inst15_q6), .I5(inst15_q5), .I4(inst15_q4), .I3(inst15_q3),
    .I2(inst15_q2), .I1(inst15_q1), .I0(inst15_q0), .O7(RAMDATA7), .O6(RAMDATA6), .O5(RAMDATA5),
    .O4(RAMDATA4), .O3(RAMDATA3), .O2(RAMDATA2), .O1(RAMDATA1), .O0(RAMDATA0));
  tri_state_gate_8 inst12 (
    .EN(inst42_out), .I7(inst60_q7), .I6(inst60_q6), .I5(inst60_q5), .I4(inst60_q4), .I3(inst60_q3),
    .I2(inst60_q2), .I1(inst60_q1), .I0(inst60_q0), .O7(inst12_o7), .O6(inst12_o6), .O5(inst12_o5),
    .O4(inst12_o4), .O3(inst12_o3), .O2(inst12_o2), .O1(inst12_o1), .O0(inst12_o0));
  not inst31 (WR, uIR3);
  not inst30 (RD, uIR2);
  not inst42 (inst42_out, uIR2);
  tri_state_gate_8 inst13 (
    .EN(uIR2), .I7(RAMDATA7), .I6(RAMDATA6), .I5(RAMDATA5), .I4(RAMDATA4), .I3(RAMDATA3), .I2(RAMDATA2),
    .I1(RAMDATA1), .I0(RAMDATA0), .O7(inst12_o7), .O6(inst12_o6), .O5(inst12_o5), .O4(inst12_o4),
    .O3(inst12_o3), .O2(inst12_o2), .O1(inst12_o1), .O0(inst12_o0));
  not inst22 (inst22_out, START_CP);
  and inst35 (inst35_out, inst22_out, inst32_y6);
  register8_with_clrn inst10 (
    .CP(inst35_out), .CLRN(CLRN), .D7(inst60_q7), .D6(inst60_q6), .D5(inst60_q5), .D4(inst60_q4),
    .D3(inst60_q3), .D2(inst60_q2), .D1(inst60_q1), .D0(inst60_q0), .Q7(RAMADDRESS7), .Q6(RAMADDRESS6),
    .Q5(RAMADDRESS5), .Q4(RAMADDRESS4), .Q3(RAMADDRESS3), .Q2(RAMADDRESS2), .Q1(RAMADDRESS1), .Q0(RAMADDRESS0));

  assign CPuIR = START_CP;
  assign uRD = START_CP;

  // Notes on the sheet:
  //   A:跳转到PC+A
  //   WR
  //   RD
  //   B:NOTA,跳转到PC+1
  //   0
  //   3
  //   if 乘法应该停止，则为1
  //   7
  //   0
  //   控制下地址
  //   uIR17:
  //   0--bufenji
  //   1--overflow
  //   overflow
  //   uIR17
  //   bufenji
  //   01 uPC++
  //   CLRN
  //   CLRN
  //   CLRN
  //   CLRN
  //   CLRN
  //   CLRN
  //   CLRN
  //   CLRN
  //   CP
  //   CP
  //   CP
  //   CP
  //   CP
  //   CP
  //   CP
  //   CP
  //   来自uPC
  //   BUS
  //   BUS
  //   BUS
  //   BUS
  //   7
  //   BUS
  //   7
  //   7
  //   BUS
  //   BUS
  //   BUS
  //   7
  //   7
  //   7
  //   7
  //   7
  //   7
  //   6
  //   6
  //   6
  //   6
  //   6
  //   6
  //   6
  //   6
  //   6
  //   5
  //   5
  //   5
  //   5
  //   5
  //   5
  //   5
  //   5
  //   4
  //   4
  //   4
  //   5
  //   4
  //   4
  //   4
  //   4
  //   4
  //   4
  //   3
  //   3
  //   3
  //   3
  //   3
  //   3
  //   3
  //   3
  //   3
  //   2
  //   2
  //   2
  //   2
  //   2
  //   2
  //   2
  //   2
  //   2
  //   1
  //   1
  //   1
  //   1
  //   1
  //   1
  //   1
  //   1
  //   1
  //   0
  //   0
  //   0
  //   0
  //   0
  //   0
  //   0
  //   CONDITION R
  //   0
  //   0
  //   CPZ
  //   暂存ALU的值
  //   计算状态位，en控制能否输出（当CPR3有效时才能输出）
  //   控制单向传输数据
  //   0--CARRY_BITES
  //   4--乘数最后一位
  //   不读的时候此线路接通
  //   1--ZERO_JUDGE
  //   C
  //   ---->
  //   5--移位器移出的部分积
  //   P
  //   <<<<<<<<<<<<
  //   2--NEGITAVE_JUDGE
  //   M
  //   3--OVERFLOW_JUDGE
  //   B
  //   R
  //   P
  //   寄存器组
  //   IR
  //   7
  //   MAR
  //   ALU
  //   clrn
  //   0
  //   PC
  //   S3S2S1S0=1001  M=0 C=0
  //   A: NOT MULTI FROM rg
  //   B: MULTI FROM BEICHENGSHU
  //   uIR 5 4:2
  //   控制单向传输数据
  //   只有当读的时候此线路才能接通，将RAM的读出值送往MBR输入端
  //   ----------------------------------------------------------------------------------------------------------------------------------------------------------------------------------------------------------------------------------------------------------------------------------------------------------------------------
  //   ROM控制区域
  //   >>>>>>>>>>>
  //   0
  //   1
  //   2
  //   3
  //   7
  //   0
  //   B7
  //   B选择器：A端口连OB，B端口连PC
  //   RD时有效
  //   A
  //   A选择器：A端口连OA，B端口连MBR
  //   P
  //   OB
  //   B
  //   M
  //   OA
  //   A
  //   C
  //   B
  //   B
  //   R
  //   A
  //   A：高八位 B：IR+0000
  //   高八位/IR+0000 选择器
  //   0
  //   0
  //   0
  //   1
  //   2
  //   3
  //   CPuPC
  //   加非门！！！
  //   uPC
  //   A选择器的B0，即MBRA
  //   A选择器的B7
  //   WR
endmodule
